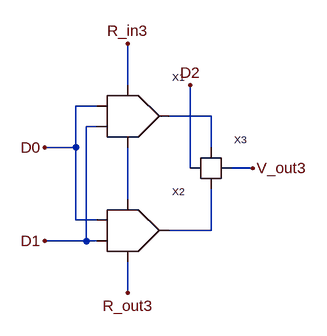
[diagram p0: schematic 3_bit_dac.asc]
3_bit_dac.asc, the LTspice schematic file:
Version 4
SHEET 1 880 680
WIRE 160 48 160 -16
WIRE 112 80 80 80
WIRE 288 96 224 96
WIRE 112 112 96 112
WIRE 80 144 80 80
WIRE 80 144 32 144
WIRE 288 144 288 96
WIRE 256 176 256 48
WIRE 352 176 320 176
WIRE 160 224 160 144
WIRE 80 256 80 144
WIRE 112 256 80 256
WIRE 288 272 288 208
WIRE 288 272 224 272
WIRE 96 288 96 112
WIRE 96 288 32 288
WIRE 112 288 96 288
WIRE 160 368 160 320
FLAG 352 176 V_out3
FLAG 32 144 D0
FLAG 32 288 D1
FLAG 160 -16 R_in3
FLAG 160 368 R_out3
FLAG 256 48 D2
SYMBOL 2_bit_dac 160 96 R0
SYMATTR InstName X1
SYMBOL 2_bit_dac 160 272 R0
SYMATTR InstName X2
SYMBOL switch 288 176 R0
SYMATTR InstName X3

The netlist it stands for:
* 3_bit_dac.asc
XX1 D0 D1 R_in3 N002 N001 2_bit_dac  ; pins D0 D1 R_in2 R_out2 V_out2
XX2 D0 D1 N002 R_out3 N003 2_bit_dac  ; pins D0 D1 R_in2 R_out2 V_out2
XX3 D2 N001 N003 V_out3 switch  ; pins digital_input Vin_1 Vin_2 Vout
.backanno
.end